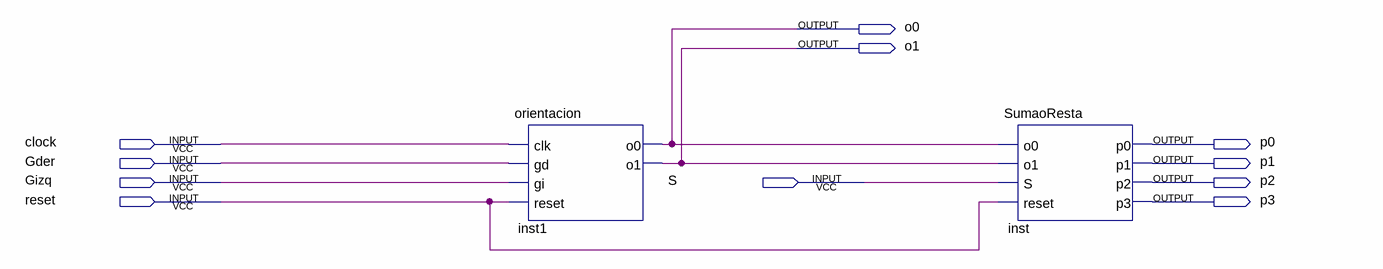
[diagram p0: schematic sheet]
// Quartus schematic ubicacion.bdf as structural Verilog: 2 symbols, 11 pins
module ubicacion (
  input  clock,
  input  Gder,
  input  Gizq,
  input  S,
  input  reset,
  output o0,
  output o1,
  output p0,
  output p1,
  output p2,
  output p3
);

  orientacion inst1 (.clk(clock), .gd(Gder), .gi(Gizq), .reset(reset), .o0(o0), .o1(o1));
  SumaoResta inst (.o0(o0), .o1(o1), .S(S), .reset(reset), .p0(p0), .p1(p1), .p2(p2), .p3(p3));
endmodule
